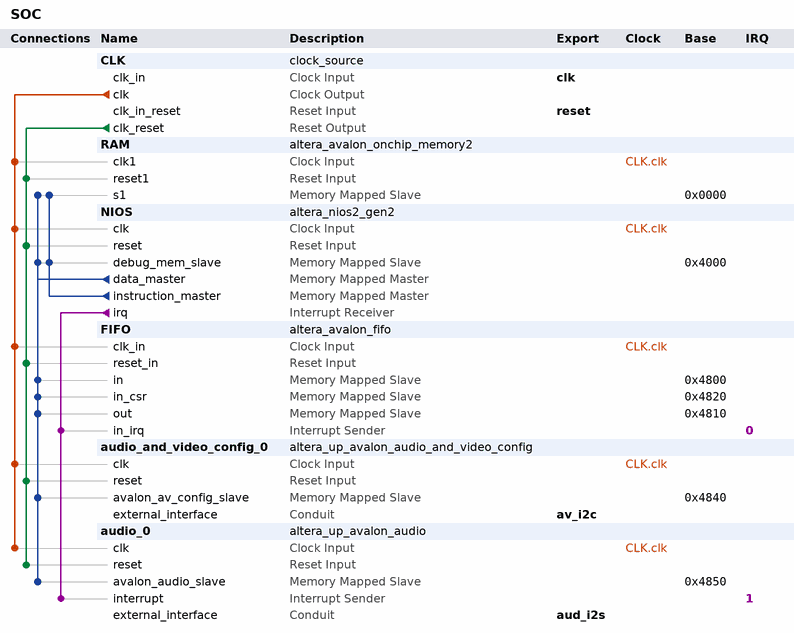
[diagram p0: system contents]
# Platform Designer (Qsys) system SOC, Cyclone V 5CGXFC7C7F23C8
# Parameters at their usual value, and those the tool derives, are not listed.
package require -exact qsys 18.0
create_system SOC
set_project_property DEVICE_FAMILY {Cyclone V}
set_project_property DEVICE 5CGXFC7C7F23C8

add_instance CLK clock_source 18.0
set_instance_parameter_value CLK clockFrequency 50000000

add_instance RAM altera_avalon_onchip_memory2 18.0
set_instance_parameter_value RAM dataWidth 32
set_instance_parameter_value RAM dualPort false
set_instance_parameter_value RAM initMemContent true
set_instance_parameter_value RAM initializationFileName onchip_mem.hex
set_instance_parameter_value RAM memorySize 16384

add_instance NIOS altera_nios2_gen2 18.0
set_instance_parameter_value NIOS dcache_size 2048
set_instance_parameter_value NIOS exceptionSlave RAM.s1
set_instance_parameter_value NIOS icache_size 4096
set_instance_parameter_value NIOS impl Fast
set_instance_parameter_value NIOS resetSlave RAM.s1

add_instance FIFO altera_avalon_fifo 18.0
set_instance_parameter_value FIFO bitsPerSymbol 16
set_instance_parameter_value FIFO channelWidth 8
set_instance_parameter_value FIFO errorWidth 8
set_instance_parameter_value FIFO fifoDepth 1024
set_instance_parameter_value FIFO fifoInputInterfaceOptions AVALONMM_WRITE
set_instance_parameter_value FIFO fifoOutputInterfaceOptions AVALONMM_READ
set_instance_parameter_value FIFO singleClockMode true
set_instance_parameter_value FIFO symbolsPerBeat 2
set_instance_parameter_value FIFO useIRQ true
set_instance_parameter_value FIFO usePacket true
set_instance_parameter_value FIFO useReadControl false

add_instance audio_and_video_config_0 altera_up_avalon_audio_and_video_config 18.0
set_instance_parameter_value audio_and_video_config_0 audio_in {Microphone to ADC}
set_instance_parameter_value audio_and_video_config_0 bit_length 24
set_instance_parameter_value audio_and_video_config_0 board DE10-Standard
set_instance_parameter_value audio_and_video_config_0 eai false
set_instance_parameter_value audio_and_video_config_0 line_in_bypass false
set_instance_parameter_value audio_and_video_config_0 sampling_rate {48 kHz}

add_instance audio_0 altera_up_avalon_audio 18.0
set_instance_parameter_value audio_0 audio_in true
set_instance_parameter_value audio_0 avalon_bus_type {Memory Mapped}
set_instance_parameter_value audio_0 dw 16

# connections
add_connection CLK.clk audio_0.clk clock
add_connection CLK.clk audio_and_video_config_0.clk clock
add_connection CLK.clk FIFO.clk_in clock
add_connection CLK.clk NIOS.clk clock
add_connection CLK.clk RAM.clk1 clock
add_connection CLK.clk_reset audio_0.reset reset
add_connection CLK.clk_reset audio_and_video_config_0.reset reset
add_connection CLK.clk_reset FIFO.reset_in reset
add_connection CLK.clk_reset NIOS.reset reset
add_connection CLK.clk_reset RAM.reset1 reset
add_connection NIOS.data_master audio_0.avalon_audio_slave avalon
set_connection_parameter_value NIOS.data_master/audio_0.avalon_audio_slave baseAddress 0x4850
add_connection NIOS.data_master audio_and_video_config_0.avalon_av_config_slave avalon
set_connection_parameter_value NIOS.data_master/audio_and_video_config_0.avalon_av_config_slave baseAddress 0x4840
add_connection NIOS.data_master FIFO.in avalon
set_connection_parameter_value NIOS.data_master/FIFO.in baseAddress 0x4800
add_connection NIOS.data_master FIFO.in_csr avalon
set_connection_parameter_value NIOS.data_master/FIFO.in_csr baseAddress 0x4820
add_connection NIOS.data_master FIFO.out avalon
set_connection_parameter_value NIOS.data_master/FIFO.out baseAddress 0x4810
add_connection NIOS.data_master NIOS.debug_mem_slave avalon
set_connection_parameter_value NIOS.data_master/NIOS.debug_mem_slave baseAddress 0x4000
add_connection NIOS.data_master RAM.s1 avalon
set_connection_parameter_value NIOS.data_master/RAM.s1 baseAddress 0x0000
add_connection NIOS.instruction_master NIOS.debug_mem_slave avalon
set_connection_parameter_value NIOS.instruction_master/NIOS.debug_mem_slave baseAddress 0x4000
add_connection NIOS.instruction_master RAM.s1 avalon
set_connection_parameter_value NIOS.instruction_master/RAM.s1 baseAddress 0x0000
add_connection NIOS.irq audio_0.interrupt interrupt
set_connection_parameter_value NIOS.irq/audio_0.interrupt irqNumber 1
add_connection NIOS.irq FIFO.in_irq interrupt
set_connection_parameter_value NIOS.irq/FIFO.in_irq irqNumber 0

# exported interfaces
add_interface aud_i2s conduit end
set_interface_property aud_i2s EXPORT_OF audio_0.external_interface
add_interface av_i2c conduit end
set_interface_property av_i2c EXPORT_OF audio_and_video_config_0.external_interface
add_interface clk clock sink
set_interface_property clk EXPORT_OF CLK.clk_in
add_interface reset reset sink
set_interface_property reset EXPORT_OF CLK.clk_in_reset

set_interconnect_requirement {$system} qsys_mm.clockCrossingAdapter HANDSHAKE
set_interconnect_requirement {$system} qsys_mm.enableEccProtection FALSE
set_interconnect_requirement {$system} qsys_mm.insertDefaultSlave FALSE
set_interconnect_requirement {$system} qsys_mm.maxAdditionalLatency 1

save_system SOC.qsys
